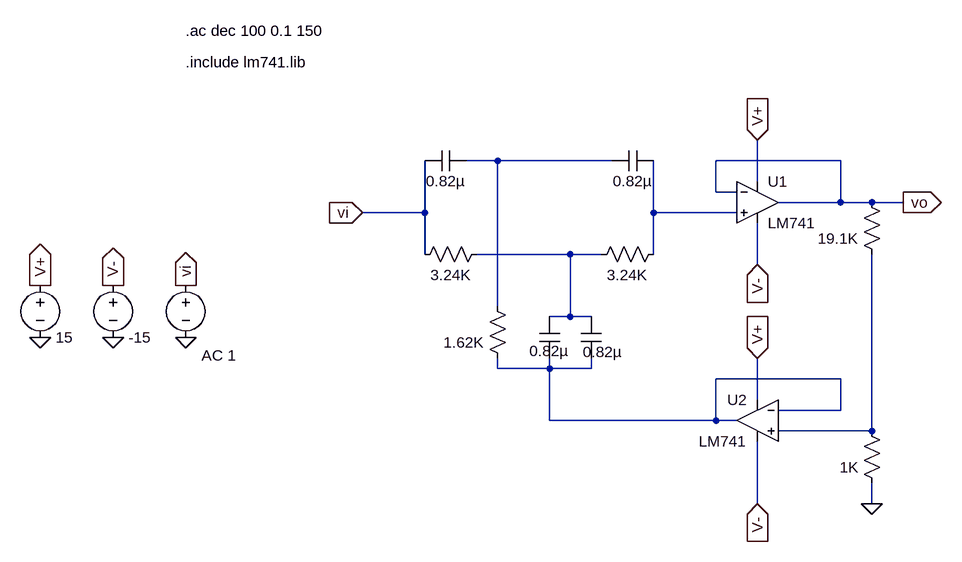
[diagram p0: schematic TwinT_sim.asc]
TwinT_sim.asc, the LTspice schematic file:
Version 4.1
SHEET 1 1352 836
WIRE 112 112 64 112
WIRE 288 112 112 112
WIRE 640 112 448 112
WIRE 512 144 512 80
WIRE 448 160 448 112
WIRE 480 160 448 160
WIRE 640 176 640 112
WIRE 640 176 544 176
WIRE 688 176 640 176
WIRE 736 176 688 176
WIRE 0 192 0 112
WIRE 0 192 -96 192
WIRE 352 192 352 112
WIRE 480 192 352 192
WIRE 0 256 0 192
WIRE 224 256 80 256
WIRE 272 256 224 256
WIRE 352 256 352 192
WIRE 512 272 512 208
WIRE 112 336 112 112
WIRE 224 352 224 256
WIRE 224 352 192 352
WIRE 256 352 224 352
WIRE 112 432 112 416
WIRE 192 432 192 416
WIRE 192 432 112 432
WIRE 256 432 256 416
WIRE 256 432 192 432
WIRE 640 448 448 448
WIRE 512 480 512 416
WIRE 640 496 640 448
WIRE 640 496 544 496
WIRE 192 512 192 432
WIRE 448 512 448 448
WIRE 448 512 192 512
WIRE 480 512 448 512
WIRE 688 528 688 256
WIRE 688 528 544 528
WIRE 512 640 512 544
WIRE 688 640 688 608
FLAG 512 80 V+
IOPIN 512 80 In
FLAG 512 416 V+
IOPIN 512 416 In
FLAG 512 272 V-
IOPIN 512 272 In
FLAG 512 640 V-
IOPIN 512 640 In
FLAG 688 640 0
FLAG -96 192 vi
IOPIN -96 192 In
FLAG 736 176 vo
IOPIN 736 176 Out
FLAG -592 384 0
FLAG -480 384 0
FLAG -368 384 0
FLAG -592 304 V+
IOPIN -592 304 Out
FLAG -480 304 V-
IOPIN -480 304 Out
FLAG -368 304 vi
IOPIN -368 304 Out
SYMBOL OpAmps\\opamp2 512 112 R0
SYMATTR InstName U1
SYMATTR Value LM741
SYMBOL OpAmps\\opamp2 512 448 M0
SYMATTR InstName U2
SYMATTR Value LM741
SYMBOL cap 64 96 R90
WINDOW 0 0 32 Invisible 2
WINDOW 3 32 32 VTop 2
SYMATTR InstName C1
SYMATTR Value 0.82µ
SYMBOL cap 352 96 R90
WINDOW 0 0 32 Invisible 2
WINDOW 3 32 32 VTop 2
SYMATTR InstName C2
SYMATTR Value 0.82µ
SYMBOL cap 208 416 R180
WINDOW 0 24 56 Invisible 2
WINDOW 3 -14 11 Left 2
SYMATTR InstName C3
SYMATTR Value 0.82µ
SYMBOL cap 272 416 R180
WINDOW 0 24 56 Invisible 2
WINDOW 3 -32 10 Left 2
SYMATTR InstName C4
SYMATTR Value 0.82µ
SYMBOL res 368 240 R90
WINDOW 0 0 56 Invisible 2
WINDOW 3 32 56 VTop 2
SYMATTR InstName R1
SYMATTR Value 3.24K
SYMBOL res 96 240 R90
WINDOW 0 0 56 Invisible 2
WINDOW 3 32 56 VTop 2
SYMATTR InstName R2
SYMATTR Value 3.24K
SYMBOL res 128 432 R180
WINDOW 0 36 76 Invisible 2
WINDOW 3 36 40 Left 2
SYMATTR InstName R3
SYMATTR Value 1.62K
SYMBOL res 704 272 R180
WINDOW 0 36 76 Invisible 2
WINDOW 3 36 40 Left 2
SYMATTR InstName R4
SYMATTR Value 19.1K
SYMBOL res 704 624 R180
WINDOW 0 36 76 Invisible 2
WINDOW 3 36 40 Left 2
SYMATTR InstName R5
SYMATTR Value 1K
SYMBOL voltage -592 288 R0
WINDOW 0 24 16 Invisible 2
WINDOW 123 0 0 Left 0
WINDOW 39 0 0 Left 0
SYMATTR InstName V1
SYMATTR Value 15
SYMBOL voltage -480 288 R0
WINDOW 0 24 16 Invisible 2
WINDOW 123 0 0 Left 0
WINDOW 39 0 0 Left 0
SYMATTR InstName V2
SYMATTR Value -15
SYMBOL voltage -368 288 R0
WINDOW 0 24 16 Invisible 2
WINDOW 123 24 124 Left 2
WINDOW 39 0 0 Left 0
SYMATTR InstName V3
SYMATTR Value ""
SYMATTR Value2 AC 1
TEXT -368 -40 Left 2 !.include lm741.lib
TEXT -368 -88 Left 2 !.ac dec 100 0.1 150

The netlist it stands for:
* TwinT_sim.asc
X§U1 N002 vo V+ V- vo LM741  ; pins In+ In- V+ V- OUT
X§U2 N005 N004 V+ V- N004 LM741  ; pins In+ In- V+ V- OUT
C1 N001 vi 0.82µ
C2 N002 N001 0.82µ
C3 N004 N003 0.82µ
C4 N004 N003 0.82µ
R1 N002 N003 3.24K
R2 N003 vi 3.24K
R3 N004 N001 1.62K
R4 N005 vo 19.1K
R5 0 N005 1K
V1 V+ 0 15
V2 V- 0 -15
V3 vi 0 AC 1
.include lm741.lib
.ac dec 100 0.1 150
.backanno
.end